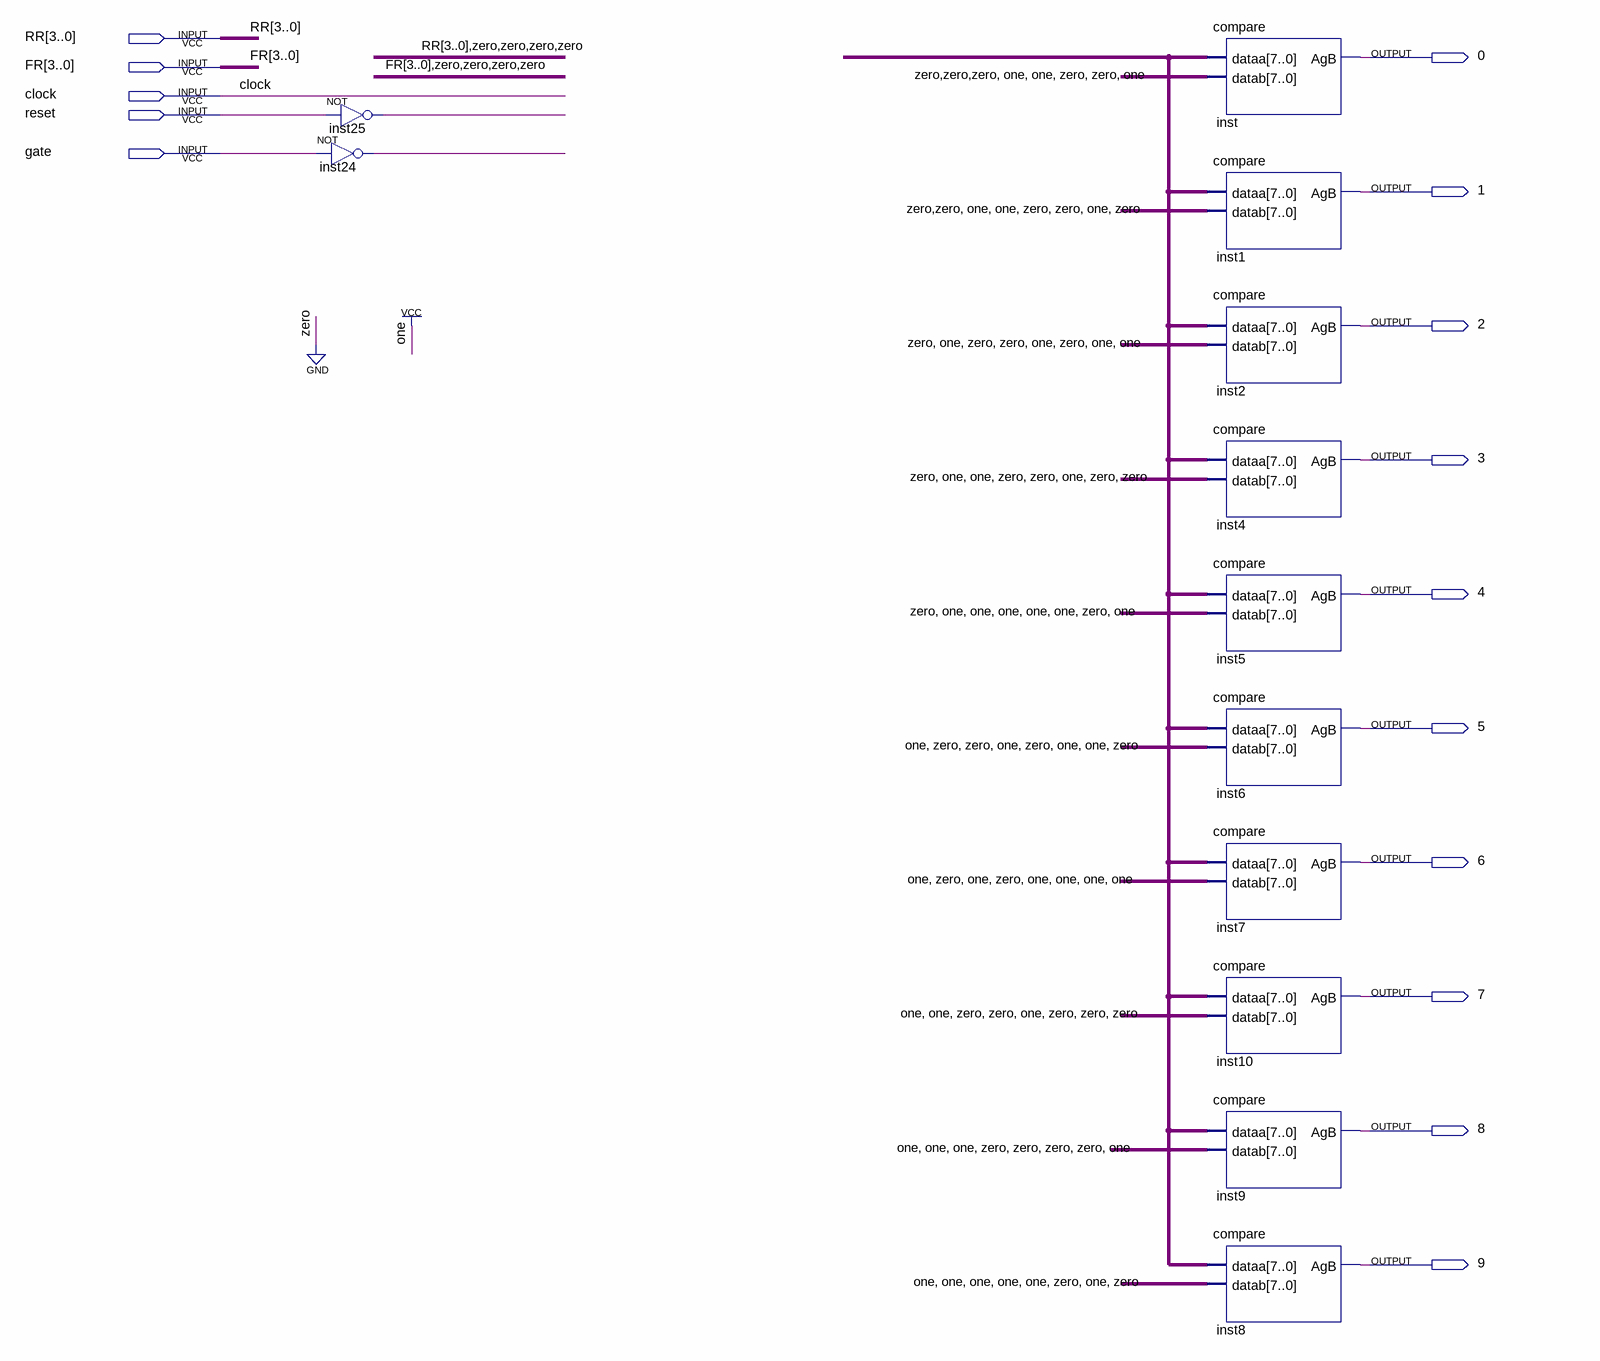
[diagram p0: schematic sheet]
// Quartus schematic TEST.bdf as structural Verilog: 12 symbols, 15 pins
module TEST (
  input  [3:0] RR,
  input  [3:0] FR,
  input  clock,
  input  reset,
  input  gate,
  output \0 ,
  output \1 ,
  output \2 ,
  output \3 ,
  output \4 ,
  output \5 ,
  output \6 ,
  output \7 ,
  output \8 ,
  output \9 
);

  wire inst24_out, inst25_out;
  wire [7:0] undriven;

  not inst25 (inst25_out, reset);
  not inst24 (inst24_out, gate);
  compare inst (.dataa(undriven), .datab(8'b00011001), .AgB(\0 ));
  compare inst1 (.dataa(undriven), .datab(8'b00110010), .AgB(\1 ));
  compare inst2 (.dataa(undriven), .datab(8'b01001011), .AgB(\2 ));
  compare inst4 (.dataa(undriven), .datab(8'b01100100), .AgB(\3 ));
  compare inst5 (.dataa(undriven), .datab(8'b01111101), .AgB(\4 ));
  compare inst6 (.dataa(undriven), .datab(8'b10010110), .AgB(\5 ));
  compare inst7 (.dataa(undriven), .datab(8'b10101111), .AgB(\6 ));
  compare inst10 (.dataa(undriven), .datab(8'b11001000), .AgB(\7 ));
  compare inst9 (.dataa(undriven), .datab(8'b11100001), .AgB(\8 ));
  compare inst8 (.dataa(undriven), .datab(8'b11111010), .AgB(\9 ));
endmodule
